# Altium project 推杆电容板V2.0.PrjPcb
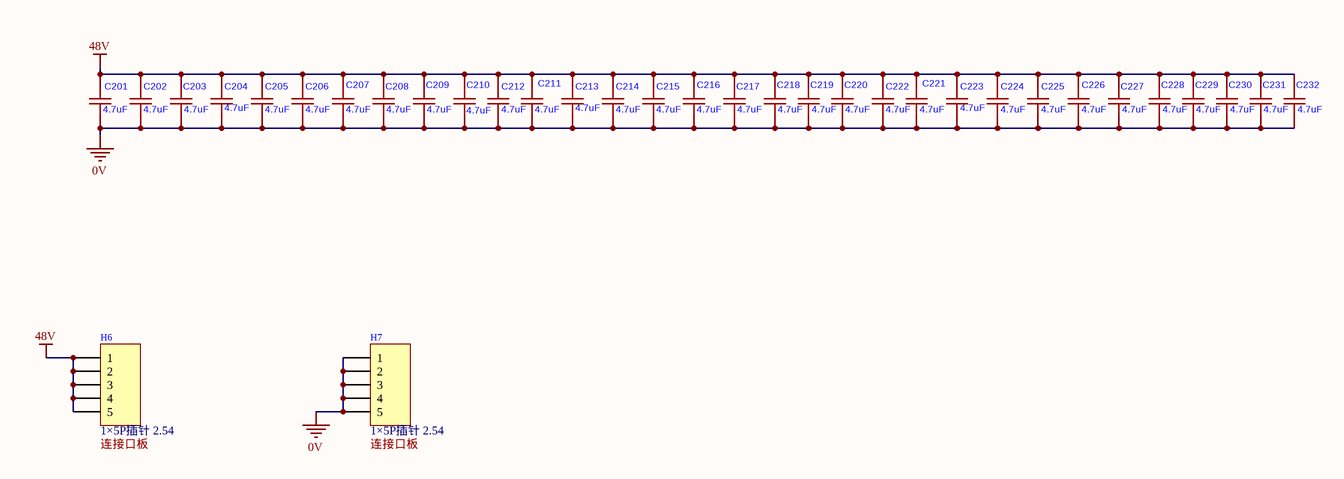
[diagram p0: 原理图V2.0.SchDoc]
1 sheet, 34 parts. Net scope: global (net labels, ports and power ports of the same name join across sheets).
Board file: 推杆电容板V2.0.PcbDoc

## Sheet 原理图V2.0.SchDoc
size A4; SheetNumber: 1; SheetTotal: 1

### Parts
C201  4.7uF  [1210_C]
C202  4.7uF  [1210_C]
C203  4.7uF  [1210_C]
C204  4.7uF  [1210_C]
C205  4.7uF  [1210_C]
C206  4.7uF  [1210_C]
C207  4.7uF  [1210_C]
C208  4.7uF  [1210_C]
C209  4.7uF  [1210_C]
C210  4.7uF  [1210_C]
C211  4.7uF  [1210_C]
C212  4.7uF  [1210_C]
C213  4.7uF  [1210_C]
C214  4.7uF  [1210_C]
C215  4.7uF  [1210_C]
C216  4.7uF  [1210_C]
C217  4.7uF  [1210_C]
C218  4.7uF  [1210_C]
C219  4.7uF  [1210_C]
C220  4.7uF  [1210_C]
C221  4.7uF  [1210_C]
C222  4.7uF  [1210_C]
C223  4.7uF  [1210_C]
C224  4.7uF  [1210_C]
C225  4.7uF  [1210_C]
C226  4.7uF  [1210_C]
C227  4.7uF  [1210_C]
C228  4.7uF  [1210_C]
C229  4.7uF  [1210_C]
C230  4.7uF  [1210_C]
C231  4.7uF  [1210_C]
C232  4.7uF  [1210_C]
H6  1×5P插针 2.54  [HDR1X5]
H7  1×5P插针 2.54  [HDR1X5]

### Nets
0V: C201.1 C202.1 C203.1 C204.1 C205.1 C206.1 C207.1 C208.1 C209.1 C210.1 C211.1 C212.1 C213.1 C214.1 C215.1 C216.1 C217.1 C218.1 C219.1 C220.1 C221.1 C222.1 C223.1 C224.1 C225.1 C226.1 C227.1 C228.1 C229.1 C230.1 C231.1 C232.1 H7.1 H7.2 H7.3 H7.4 H7.5
48V: C201.2 C202.2 C203.2 C204.2 C205.2 C206.2 C207.2 C208.2 C209.2 C210.2 C211.2 C212.2 C213.2 C214.2 C215.2 C216.2 C217.2 C218.2 C219.2 C220.2 C221.2 C222.2 C223.2 C224.2 C225.2 C226.2 C227.2 C228.2 C229.2 C230.2 C231.2 C232.2 H6.1 H6.2 H6.3 H6.4 H6.5

### Notes on the sheet
- (near H6) 连接口板
- (near H7) 连接口板

### Library data of the parts
C201-C232 = 1210 4.7uf: 100V 4.7uf 1210; Manufacturer: FH(风华); Symbol: 1210B475K101NT; Add into BOM: yes; Tolerance: ±10%; Temperature Coefficient: X7R; Device: 1210B475K101NT; LCSC Part Name: 4.7uF ±10% 100V; Supplier Part: C2840282; Manufacturer Part: 1210B475K101NT; Supplier Footprint: 1210; JLCPCB Part Class: Extended Part; Datasheet: https://atta.szlcsc.com/upload/public/pdf/source/20210617/C2840282_5B7AB5BFD77495008CFAB3FC2796A0E9.pdf; Supplier: LCSC; Convert to PCB: yes; Value: 4.7uF; Voltage Rated: 100V
H6 H7 = Header 5: Header, 5-Pin; LatestRevisionDate: 17-Jul-2002; LatestRevisionNote: Re-released for DXP Platform.; Publisher: Altium Limited